# Altium schematic sheet GE910QUAD Modem.SchDoc: GE910 GSM Modem & SIM
size A3; SheetNumber: 24; SheetTotal: 37
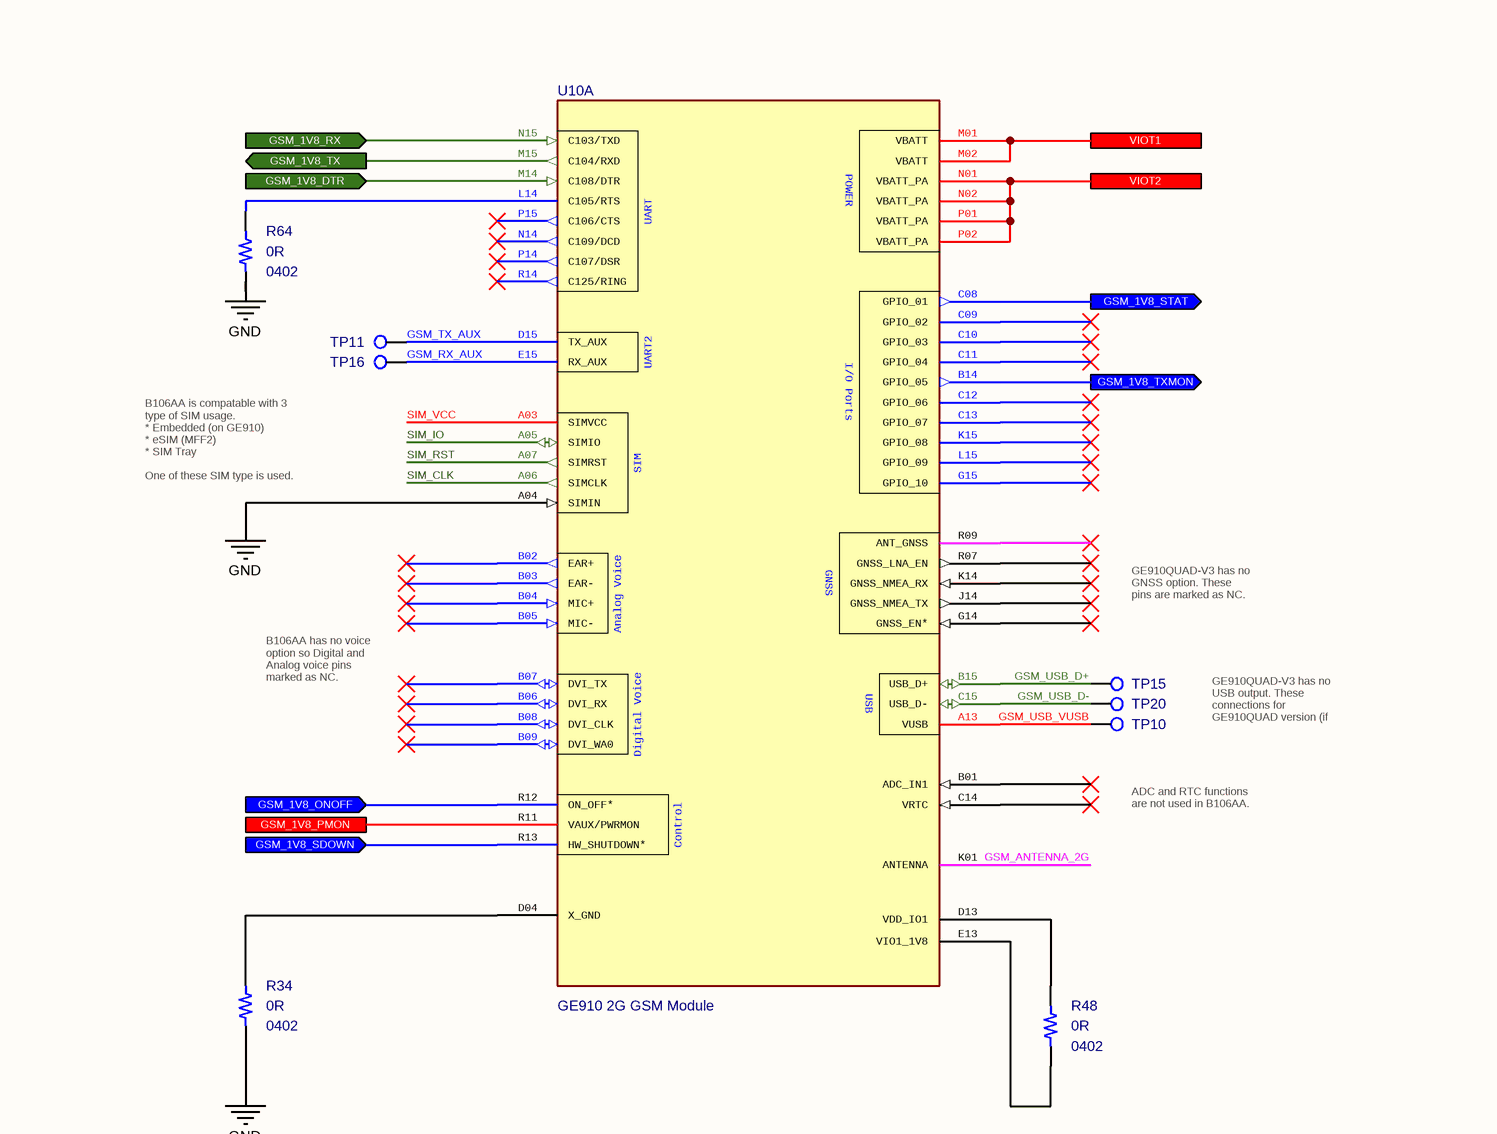
[diagram p0: GE910QUAD Modem.SchDoc, top left]
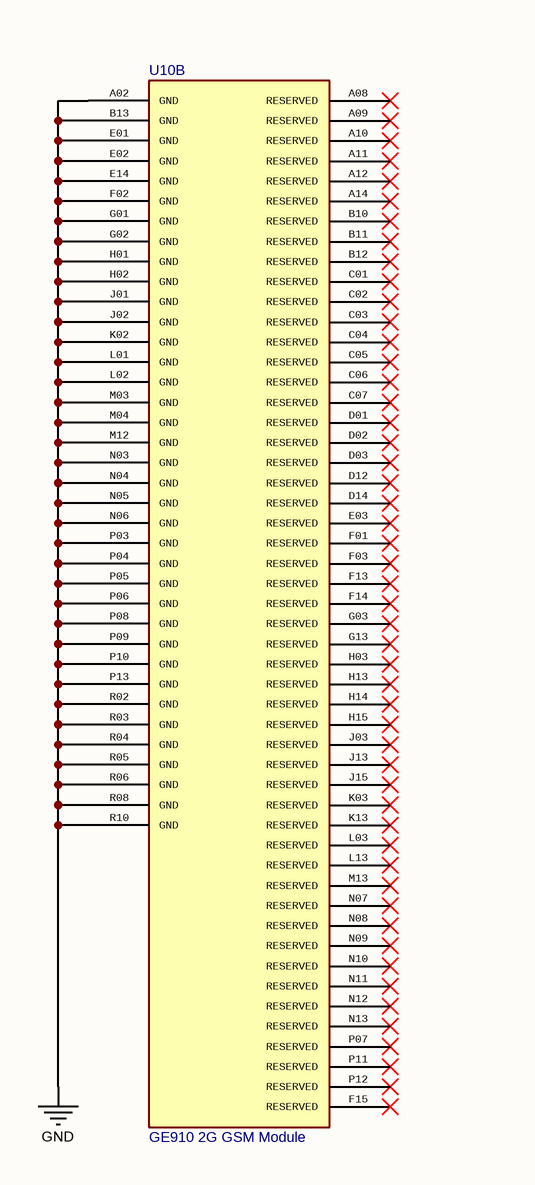
[diagram p1: GE910QUAD Modem.SchDoc, top right]
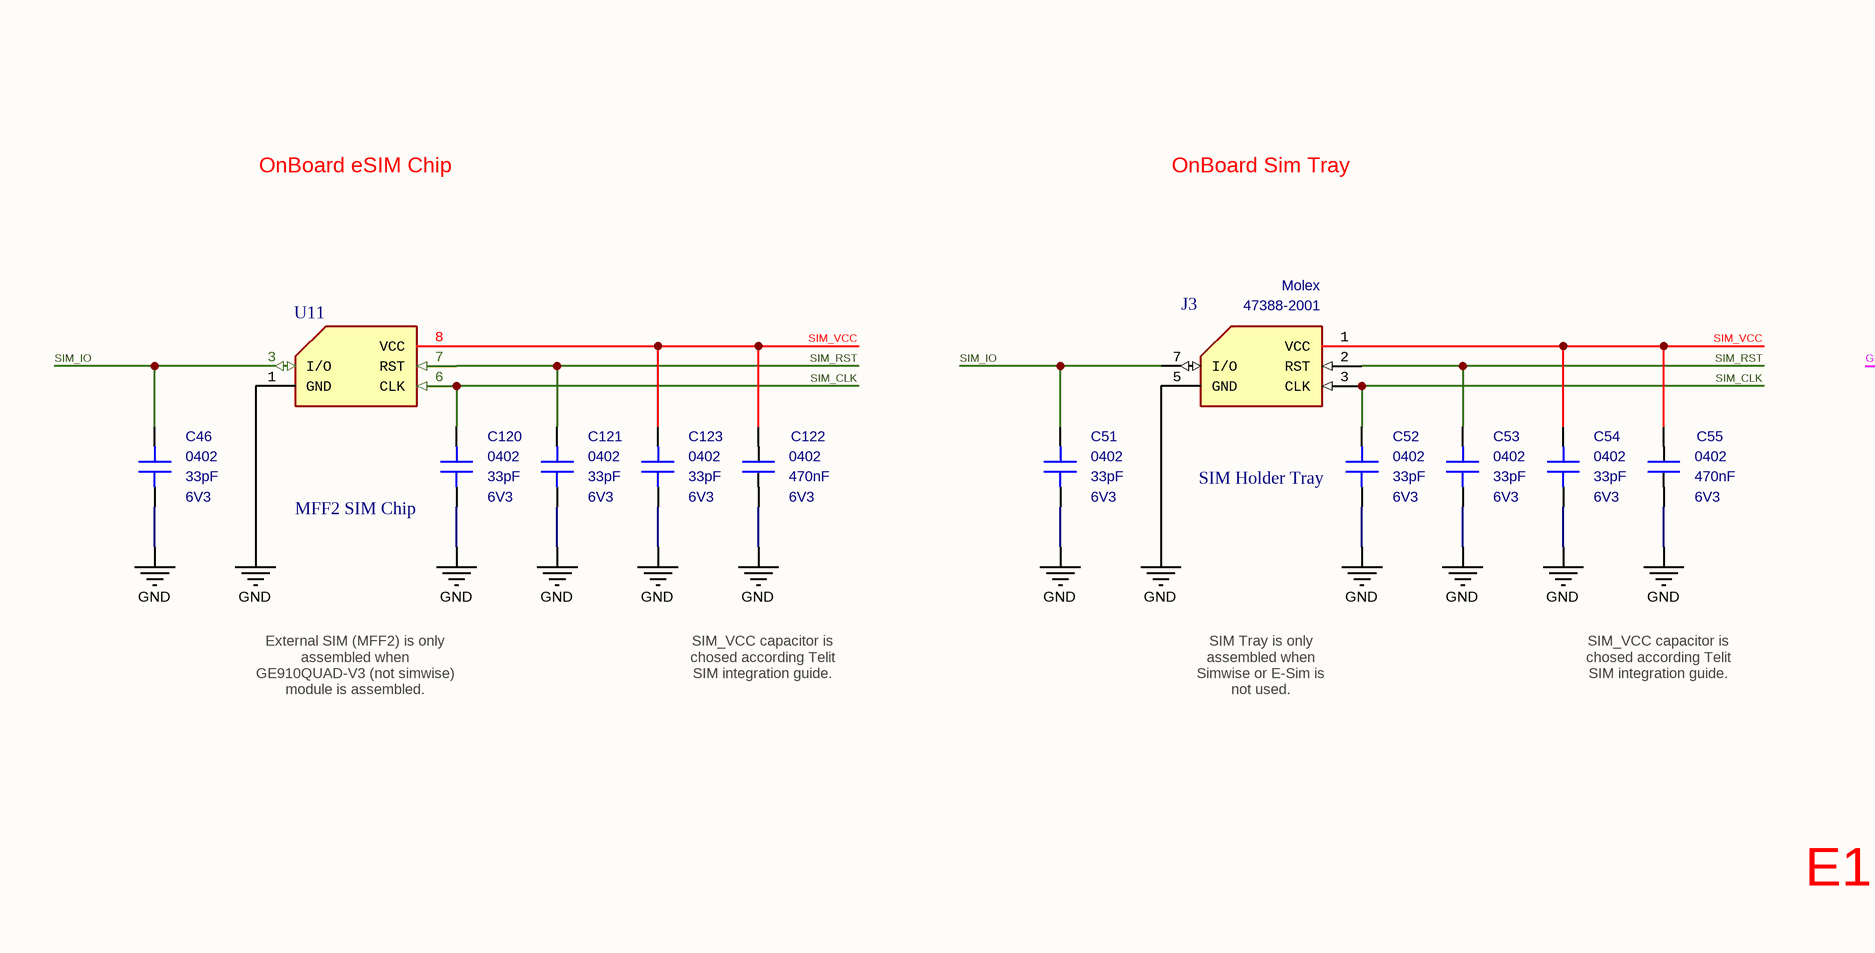
[diagram p2: GE910QUAD Modem.SchDoc, bottom left]
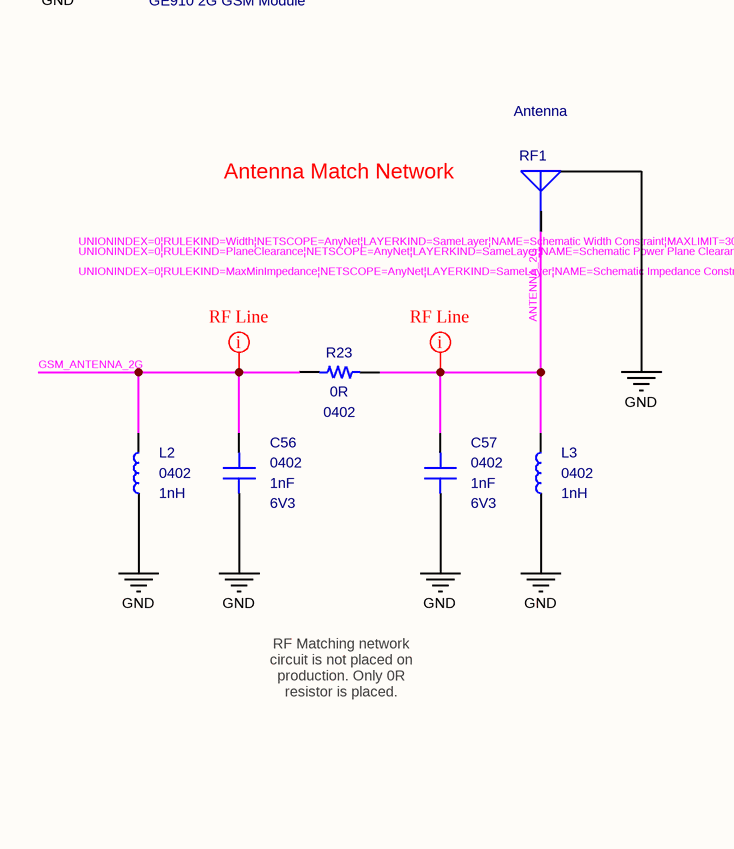
[diagram p3: GE910QUAD Modem.SchDoc, bottom right]

## Parts
C46  value 33pF  Case: 0402  Voltage: 6V3  [CAPACITOR_0402]  (hidden comment: Multilayer Ceramic Capacitor)
C51  value 33pF  Case: 0402  Voltage: 6V3  [CAPACITOR_0402]  (hidden comment: Multilayer Ceramic Capacitor)
C52  value 33pF  Case: 0402  Voltage: 6V3  [CAPACITOR_0402]  (hidden comment: Multilayer Ceramic Capacitor)
C53  value 33pF  Case: 0402  Voltage: 6V3  [CAPACITOR_0402]  (hidden comment: Multilayer Ceramic Capacitor)
C54  value 33pF  Case: 0402  Voltage: 6V3  [CAPACITOR_0402]  (hidden comment: Multilayer Ceramic Capacitor)
C55  value 470nF  Case: 0402  Voltage: 6V3  [CAPACITOR_0402]  (hidden comment: Multilayer Ceramic Capacitors)
C56  value 1nF  Case: 0402  Voltage: 6V3  [CAPACITOR_0402]  (hidden comment: Multilayer Ceramic Capacitor)
C57  value 1nF  Case: 0402  Voltage: 6V3  [CAPACITOR_0402]  (hidden comment: Multilayer Ceramic Capacitor)
C120  value 33pF  Case: 0402  Voltage: 6V3  [CAPACITOR_0402]  (hidden comment: Multilayer Ceramic Capacitor)
C121  value 33pF  Case: 0402  Voltage: 6V3  [CAPACITOR_0402]  (hidden comment: Multilayer Ceramic Capacitor)
C122  value 470nF  Case: 0402  Voltage: 6V3  [CAPACITOR_0402]  (hidden comment: Multilayer Ceramic Capacitors)
C123  value 33pF  Case: 0402  Voltage: 6V3  [CAPACITOR_0402]  (hidden comment: Multilayer Ceramic Capacitor)
J3  SIM Holder Tray  Manufacturer_Name: Molex  Manufacturer_Part_Number: 47388-2001  [Connector - SIM Tray]
L2  value 1nH  Case: 0402  [INDUCTOR_0402]  (hidden comment: Fixed Inductor)
L3  value 1nH  Case: 0402  [INDUCTOR_0402]  (hidden comment: Fixed Inductor)
R23  value 0R  Case: 0402  [RESISTOR_0402]  (hidden comment: Thick Film Resistor)
R34  value 0R  Case: 0402  [RESISTOR_0402]  (hidden comment: Thick Film Resistor)
R48  value 0R  Case: 0402  [RESISTOR_0402]  (hidden comment: Thick Film Resistor)
R64  value 0R  Case: 0402  [RESISTOR_0402]  (hidden comment: Thick Film Resistor)
RF1  Antenna  [Connector_IPEX]
TP10  PCB - Test Point  [Test_Pad - Hole]  (value not drawn)  (no BOM)
TP11  PCB - Test Point  [Test_Pad - Hole]  (value not drawn)  (no BOM)
TP15  PCB - Test Point  [Test_Pad - Hole]  (value not drawn)  (no BOM)
TP16  PCB - Test Point  [Test_Pad - Hole]  (value not drawn)  (no BOM)
TP20  PCB - Test Point  [Test_Pad - Hole]  (value not drawn)  (no BOM)
U10  GE910 2G GSM Module  [GE910 2G GSM Modem]  (parts A,B of 2)
U11  MFF2 SIM Chip  [MFF2]

## Ports
GSM_1V8_DTR (in), GSM_1V8_ONOFF (in), GSM_1V8_PMON, GSM_1V8_RX (in), GSM_1V8_SDOWN (in), GSM_1V8_STAT (out), GSM_1V8_TX (out), GSM_1V8_TXMON (out), VIOT1, VIOT2

## Nets
GND: C46.1 C51.1 C52.1 C53.1 C54.1 C55.1 C56.1 C57.1 C120.1 C121.1 C122.1 C123.1 J3.5(GND) L2.1 L3.1 R34.1 R64.1 RF1.2(GND) U10.A02(GND) U10.A04(SIMIN) U10.B13(GND) U10.E01(GND) U10.E02(GND) U10.E14(GND) U10.F02(GND) U10.G01(GND) U10.G02(GND) U10.H01(GND) U10.H02(GND) U10.J01(GND) U10.J02(GND) U10.K02(GND) U10.L01(GND) U10.L02(GND) U10.M03(GND) U10.M04(GND) U10.M12(GND) U10.N03(GND) U10.N04(GND) U10.N05(GND) U10.N06(GND) U10.P03(GND) U10.P04(GND) U10.P05(GND) U10.P06(GND) U10.P08(GND) U10.P09(GND) U10.P10(GND) U10.P13(GND) U10.R02(GND) U10.R03(GND) U10.R04(GND) U10.R05(GND) U10.R06(GND) U10.R08(GND) U10.R10(GND) U11.1(GND)
ANTENNA_2G: C57.2 L3.2 R23.1 RF1.1(Signal)
GSM_1V8_DTR: U10.M14(C108/DTR) ; port GSM_1V8_DTR
GSM_1V8_ONOFF: U10.R12(ON_OFF*) ; port GSM_1V8_ONOFF
GSM_1V8_PMON: U10.R11(VAUX/PWRMON) ; port GSM_1V8_PMON
GSM_1V8_RX: U10.N15(C103/TXD) ; port GSM_1V8_RX
GSM_1V8_SDOWN: U10.R13(HW_SHUTDOWN*) ; port GSM_1V8_SDOWN
GSM_1V8_STAT: U10.C08(GPIO_01) ; port GSM_1V8_STAT
GSM_1V8_TX: U10.M15(C104/RXD) ; port GSM_1V8_TX
GSM_1V8_TXMON: U10.B14(GPIO_05) ; port GSM_1V8_TXMON
GSM_ANTENNA_2G: C56.2 L2.2 R23.2 U10.K01(ANTENNA)
GSM_RX_AUX: TP16.1 U10.E15(RX_AUX)
GSM_TX_AUX: TP11.1 U10.D15(TX_AUX)
GSM_USB_D+: TP15.1 U10.B15(USB_D+)
GSM_USB_D-: TP20.1 U10.C15(USB_D-)
GSM_USB_VUSB: TP10.1 U10.A13(VUSB)
SIM_CLK: C52.2 C120.2 J3.3(CLK) U10.A06(SIMCLK) U11.6(CLK)
SIM_IO: C46.2 C51.2 J3.7(I/O) U10.A05(SIMIO) U11.3(I/O)
SIM_RST: C53.2 C121.2 J3.2(RST) U10.A07(SIMRST) U11.7(RST)
SIM_VCC: C54.2 C55.2 C122.2 C123.2 J3.1(VCC) U10.A03(SIMVCC) U11.8(VCC)
VIOT1: U10.M01(VBATT) U10.M02(VBATT) ; port VIOT1
VIOT2: U10.N01(VBATT_PA) U10.N02(VBATT_PA) U10.P01(VBATT_PA) U10.P02(VBATT_PA) ; port VIOT2
NetR34_2: R34.2 U10.D04(X_GND)
NetR48_1: R48.1 U10.E13(VIO1_1V8)
NetR48_2: R48.2 U10.D13(VDD_IO1)
NetR64_2: R64.2 U10.L14(C105/RTS)

Not connected (* = marked no-connect by the designer): U10 A08(RESERVED)* A09(RESERVED)* A10(RESERVED)* A11(RESERVED)* A12(RESERVED)* A14(RESERVED)* B01(ADC_IN1)* B02(EAR+)* B03(EAR-)* B04(MIC+)* B05(MIC-)* B06(DVI_RX)* B07(DVI_TX)* B08(DVI_CLK)* B09(DVI_WA0)* B10(RESERVED)* B11(RESERVED)* B12(RESERVED)* C01(RESERVED)* C02(RESERVED)* C03(RESERVED)* C04(RESERVED)* C05(RESERVED)* C06(RESERVED)* C07(RESERVED)* C09(GPIO_02)* C10(GPIO_03)* C11(GPIO_04)* C12(GPIO_06)* C13(GPIO_07)* C14(VRTC)* D01(RESERVED)* D02(RESERVED)* D03(RESERVED)* D12(RESERVED)* D14(RESERVED)* E03(RESERVED)* F01(RESERVED)* F03(RESERVED)* F13(RESERVED)* F14(RESERVED)* F15(RESERVED)* G03(RESERVED)* G13(RESERVED)* G14(GNSS_EN*)* G15(GPIO_10)* H03(RESERVED)* H13(RESERVED)* H14(RESERVED)* H15(RESERVED)* J03(RESERVED)* J13(RESERVED)* J14(GNSS_NMEA_TX)* J15(RESERVED)* K03(RESERVED)* K13(RESERVED)* K14(GNSS_NMEA_RX)* K15(GPIO_08)* L03(RESERVED)* L13(RESERVED)* L15(GPIO_09)* M13(RESERVED)* N07(RESERVED)* N08(RESERVED)* N09(RESERVED)* N10(RESERVED)* N11(RESERVED)* N12(RESERVED)* N13(RESERVED)* N14(C109/DCD)* P07(RESERVED)* P11(RESERVED)* P12(RESERVED)* P14(C107/DSR)* P15(C106/CTS)* R07(GNSS_LNA_EN)* R09(ANT_GNSS)* R14(C125/RING)*; U11 2(NC) 4(NC) 5(NC)

## Layout directives
rule Impedance Constraint [Min = 49.00    Max = 50.00    ]; rule Power Plane Clearance [Clearance = 5.906mil]; rule Width Constraint [Pref Width = 0.77mm    Min Width = 0.77mm    Max Width = 0.77mm]: ANTENNA_2G, GSM_ANTENNA_2G

## Notes on the sheet
- B106AA is compatable with 3 type of SIM usage.
  * Embedded (on GE910)
  * eSIM (MFF2)
  * SIM Tray
  One of these SIM type is used.
- GE910QUAD-V3 has no GNSS option. These pins are marked as NC.
- B106AA has no voice option so Digital and Analog voice pins marked as NC.
- GE910QUAD-V3 has no USB output. These connections for GE910QUAD version (if assembled).
- ADC and RTC functions are not used in B106AA.
- OnBoard eSIM Chip
- OnBoard Sim Tray
- Antenna Match Network
- SIM_VCC capacitor is chosed according Telit SIM integration guide.
- SIM Tray is only assembled when Simwise or E-Sim is not used.
- RF Matching network circuit is not placed on production. Only 0R resistor is placed.
- External SIM (MFF2) is only assembled when GE910QUAD-V3 (not simwise) module is assembled.
- E1
- Title
- Size:
- Date:
- A3
- Number:
- Time:
- Revision:
- Sheet
- of
- File:
- (in symbol IC - Telit GE910QUAD, part A) POWER; UART; UART2; I/O Ports; SIM; GNSS; Analog Voice; USB; Digital Voice; Control

## Library data of the parts
C46 C51-C54 C120 C121 C123 = Capacitor - 33pF [0402-6V3]: Capacitor - 33pF [0402] (Ceramic); Manufacturer_Name: Kemet; Manufacturer_Part_Number: C0402C330J9RACAUTO; Dielectric: X7R; Tolerance: 10%; Height: 0.5mm; Mouser_Part_Number: 80-C0402C330J9RAUTO; Maximum Operating Temperature: +125; Minimum Operating Temperature: -55; ROHS: Yes; ComponentLink1Description: DataSheet; ComponentLink1URL: https://api.kemet.com/component-edge/download/datasheet/C0402C330J9RACAUTO.pdf; ComponentLink2Description: Mouser; ComponentLink2URL: https://www.mouser.com/Search/Refine.aspx?Keyword=80-C0402C330J9RAUTO; Supplier 1: Mouser; Supplier Part Number 1: 80-C0402C330J9RAUTO
C55 C122 = Capacitor - 470nF [0402-6V3]: Capacitor - 470nF [0402] (Ceramic); Manufacturer_Name: AVX; Manufacturer_Part_Number: 04026C474KAT2A; Dielectric: X7R; Tolerance: %10; Height: 0.4mm; Mouser_Part_Number: 581-04026C474KAT2A; ComponentLink1Description: Mouser; ComponentLink1URL: https://www.mouser.com.tr/ProductDetail/AVX/04026D104KAT4A?qs=sGAEpiMZZMs0AnBnWHyRQPg4iYkCw7IMED%2F4kpqgf7w%3D; ComponentLink2Description: DataSheet; ComponentLink2URL: https://www.mouser.com.tr/datasheet/2/40/cx5r-776519.pdf; ROHS: Yes; Maximum Operating Temperature: +125; Minimum Operating Temperature: -55; Supplier 1: Mouser; Supplier Part Number 1: 581-04026C474KAT2A
C56 C57 = Capacitor - 1nF [0402-6V3): Capacitor - 1nF [0402] (Ceramic); Manufacturer_Name: AVX; Manufacturer_Part_Number: 04026C102MAT2A; Dielectric: X7R; Tolerance: 20%; Height: 0.25mm; Mouser_Part_Number: 581-04026C102MAT2A; Mouser Price/Stock: 0.074; Maximum Operating Temperature: +125; Minimum Operating Temperature: -55; ROHS: Yes; Weight: 0.65mg; ComponentLink1Description: Datasheet; ComponentLink1URL: https://www.mouser.com.tr/datasheet/2/40/X7RDielectric-777024.pdf; Supplier 1: Mouser; Supplier Part Number 1: 581-04026C102MAT2A
J3 = Connector - Sim Holder: Memory Card Connectors ASSY 1.90 SIM CARD R IM CARD READER CONN.; Card Type: Mini SIM; Mouser_Part_Number: 538-47388-2001; Supplier 1: Arrow; Supplier 2: Mouser; Supplier 3: Farnell; Supplier Part Number 1: 47388-2001; Supplier Part Number 2: 538-47388-2001; Supplier Part Number 3: 2426322
L2 L3 = Inductor - 1nH [0402]: Manufacturer_Name: Murata Electronics; Manufacturer_Part_Number: LQG15HN1N0S02D; Tolerance: 0.3 nH; Height: 0.35mm; Mouser_Part_Number: 81-LQG15HN1N0S02D; ComponentLink1Description: DataSheet; ComponentLink1URL: https://www.mouser.com.tr/datasheet/2/281/JELF243B-0009-1699631.pdf; ComponentLink2Description: Mouser; ComponentLink2URL: https://www.mouser.com.tr/ProductDetail/Murata-Electronics/LQG15HN1N0S02D?qs=sGAEpiMZZMsg%252By3WlYCkUySk0uOsB1dTfJeMbA4C8Pk%3D; Supplier 1: Future Electronics; Supplier 2: Future Electronics; Supplier 3: Mouser; Supplier 4: Arrow; Supplier 5: Digi-Key; Supplier Part Number 1: LQG15HN1N0S02D-CUTT; Supplier Part Number 2: LQG15HN1N0S02D-REEL; Supplier Part Number 3: 81-LQG15HN1N0S02D; Supplier Part Number 4: LQG15HN1N0S02D; Supplier Part Number 5: 490-1073-1-ND
R23 R34 R48 R64 = Resistor - 0R: Thick Film Resistors - SMD 1/16 W 0 Ohms; Manufacturer_Name: Vishay; Manufacturer_Part_Number: CRCW04020000Z0ED; Height: 0.4mm; Mouser_Part_Number: 71-CRCW0402-0-E3; ComponentLink1Description: DataSheet; ComponentLink1URL: https://www.mouser.com.tr/datasheet/2/427/dcrcwe3-1762152.pdf; ComponentLink2Description: Mouser; ComponentLink2URL: https://www.mouser.com.tr/ProductDetail/Vishay-Dale/CRCW04020000Z0ED?qs=sGAEpiMZZMu61qfTUdNhG2DpbjADlD3GG34cJb50zyg%3D; Supplier 1: Mouser; Supplier 2: Digi-Key; Supplier Part Number 1: 71-CRCW0402-0-E3; Supplier Part Number 2: 541-0.0JCT-ND
RF1 = Connector - MHF: MHF Antenna Socket; ROHS: Yes; Supplier 1: Mouser; Supplier 2: Arrow; Supplier Part Number 1: 200-RSP-122811-01; Supplier Part Number 2: RSP-122811-01
TP10 TP11 TP15 TP16 TP20 = PCB - Test Point: Test Point
U10 = IC - Telit GE910QUAD: Telit GE910 GPRS/UMTS Module; Supplier: Telit; Value: GE910QUAD; ComponentLink1Description: Product Page; ComponentLink1URL: https://www.telit.com/product-series/ge910/
U11 = IC - MFF2: SIM Chip MFF2